# EAGLE schematic Anemometro_08_05 (EAGLE 4.09)
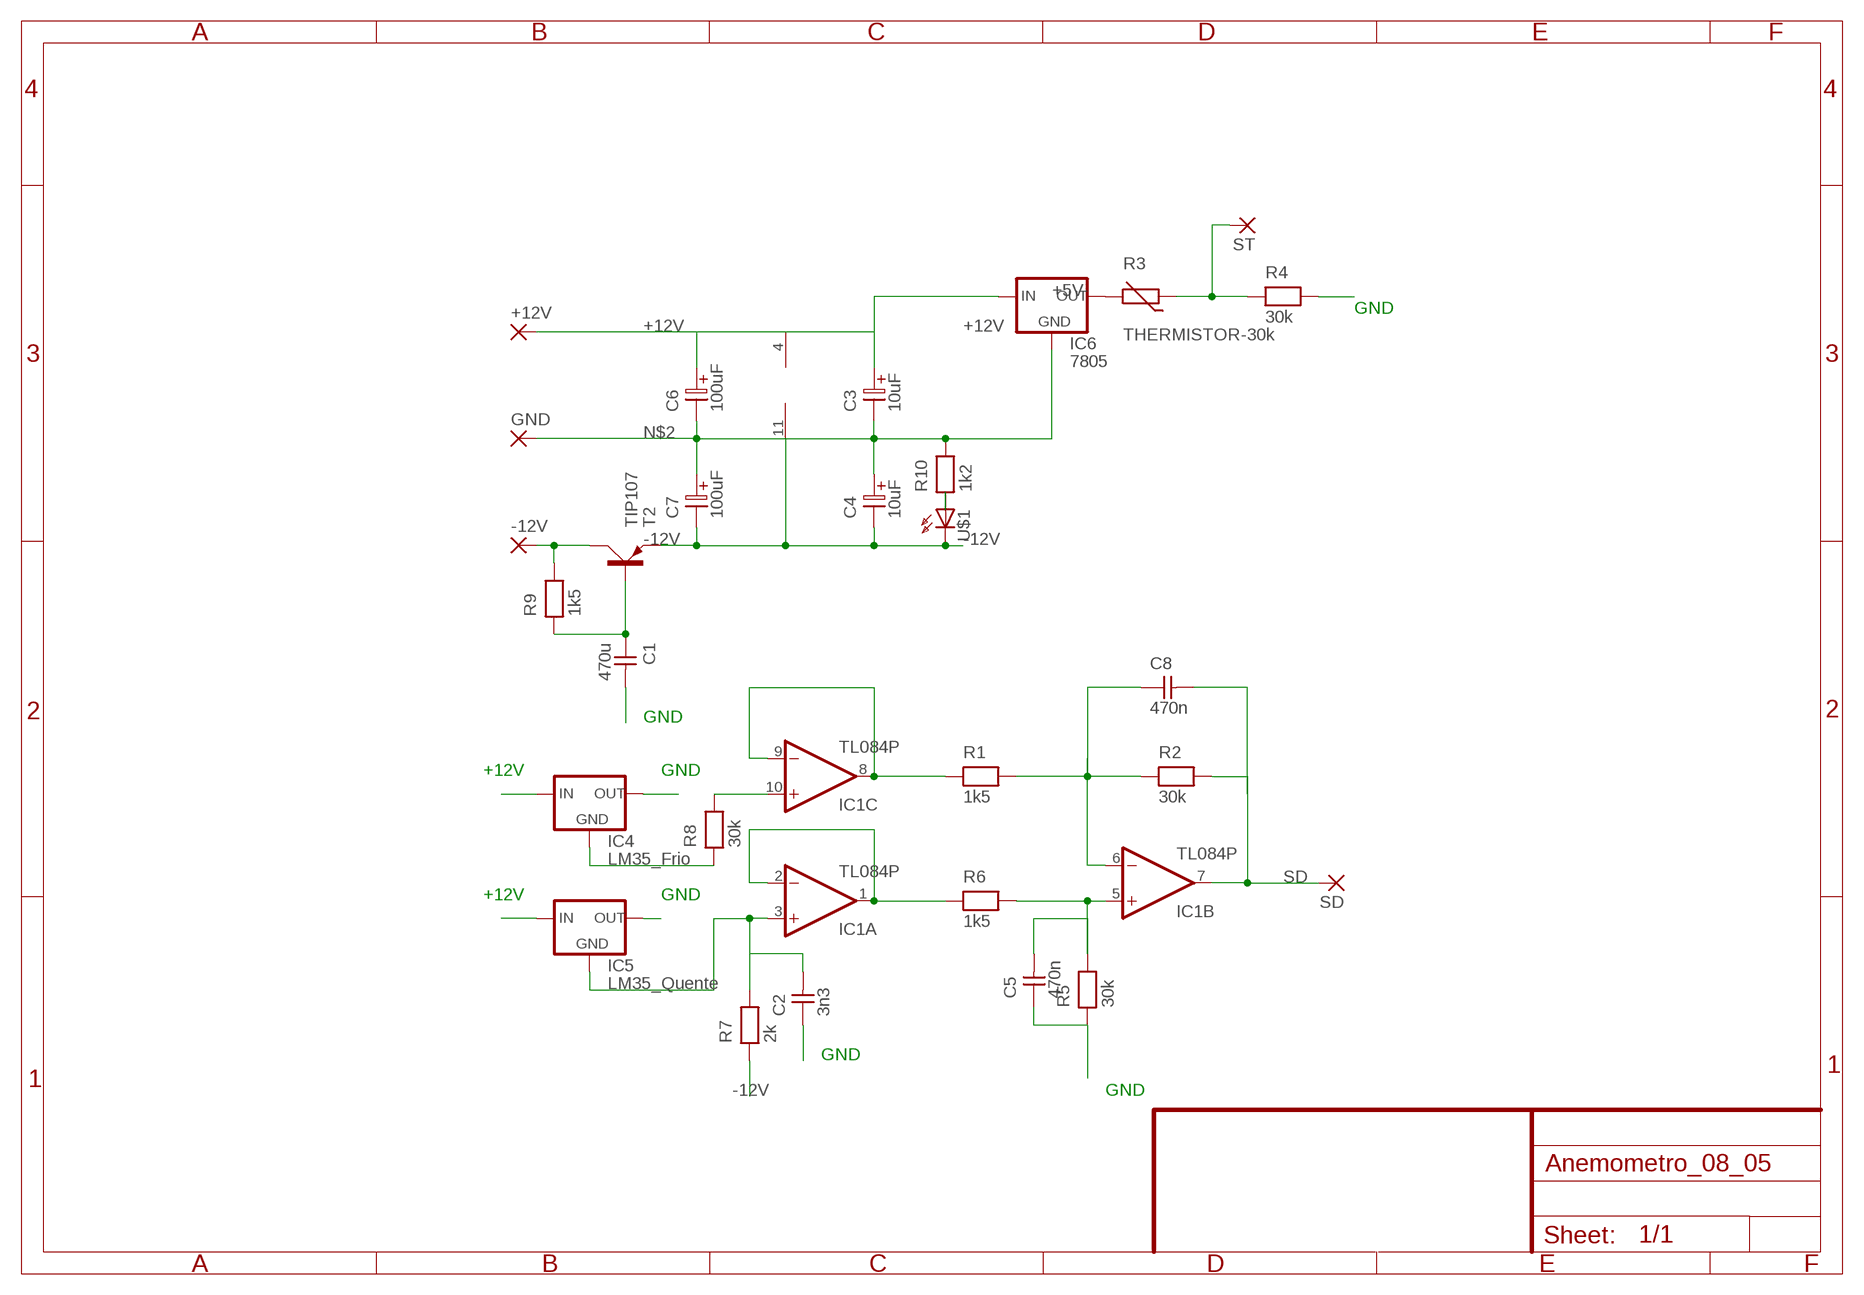
[diagram p0: schematic, sheet 1]

## Parts
+12V  2,15/1,0  [2,15/1,0]
-12V  2,15/1,0  [2,15/1,0]
C1  470u  CAPNP-7,5  [C-7,5]
C2  3n3  CAPNP-5  [C-5]
C3  10uF  ELC-2,5L  [ES-2,5L]
C4  10uF  ELC-2,5L  [ES-2,5L]
C5  470n  CAPNP-5  [C-5]
C6  100uF  ELC-5  [ES-5]
C7  100uF  ELC-5  [ES-5]
C8  470n  CAPNP-5  [C-5]
GND  2,15/1,0  [2,15/1,0]
IC1  TL084P  [DIL14]
IC4  LM35_Frio  78XXS  [78XXS]
IC5  LM35_Quente  78XXS  [78XXS]
IC6  7805  78XXS  [78XXS]
R1  1k5  RESEU-10  [R-10]
R2  30k  RESEU-10  [R-10]
R3  THERMISTOR-30k  THERMISTOR-2,5  [RS-2,5]
R4  30k  RESEU-10  [R-10]
R5  30k  RESEU-10  [R-10]
R6  1k5  RESEU-10  [R-10]
R7  2k  RESEU-10  [R-10]
R8  30k  RESEU-10  [R-10]
R9  1k5  RESEU-10  [R-10]
R10  1k2  RESEU-10  [R-10]
SD  2,15/1,0  [2,15/1,0]
ST  2,15/1,0  [2,15/1,0]
T2  TIP107  TIP42C  [TO220AV]
U$1  LED3MM  [LED3MM]

## Nets
+5V: IC6.OUT R3.2
+12V: +12V.1(P) C3.1 C6.1 IC1.4(P:V+) IC4.IN IC5.IN IC6.IN
-12V: C4.2 C7.2 IC1.11(P:V-) R7.1 T2.E U$1.K(C)
N$1: -12V.1(P) R9.2 T2.C
N$2: C1.2 C2.1 C3.2 C4.1 C5.1 C6.2 C7.1 GND.1(P) IC4.OUT IC5.OUT IC6.GND R4.2 R5.1 R10.1 R10.2 U$1.A
N$4: IC4.GND R8.1
N$5: R3.1 R4.1 ST.1(P)
N$7: IC1.8(C:OUT) IC1.9(C:-IN) R1.1
N$8: C1.1 R9.1 T2.B
N$11: IC1.1(A:OUT) IC1.2(A:-IN) R6.1
N$13: IC1.10(C:+IN) R8.2
N$21: C8.1 IC1.6(B:-IN) R1.2 R2.1
N$22: C5.2 IC1.5(B:+IN) R5.2 R6.2
N$23: C2.2 IC1.3(A:+IN) IC5.GND R7.2
SD: C8.2 IC1.7(B:OUT) R2.2 SD.1(P)
Unconnected: IC1.12(D:+IN) IC1.13(D:-IN) IC1.14(D:OUT)

## Notes on the sheet
- GND
- GND
- +12V | GND
- +12V | GND
- GND
- GND

## Library data of the parts
+12V -12V GND SD ST = wirepad:2,15/1,0: THROUGH-HOLE PAD
C1 = discrete:CAPNP-7,5
C2 C5 C8 = discrete:CAPNP-5
C3 C4 = discrete:ELC-2,5L
C6 C7 = discrete:ELC-5
IC1 = linear:TL084: OP AMP
IC4-IC6 = v-reg:78XXS: VOLTAGE REGULATOR
R1 R2 R4-R10 = discrete:RESEU-10
R3 = varistor:THERMISTOR: THERMISTOR
T2 = transistor-power:TIP42C: PNP TRANSISTOR
U$1 = led:LED: LED